# EAGLE schematic ESP32 Adapter Board (EAGLE 9.3.2)
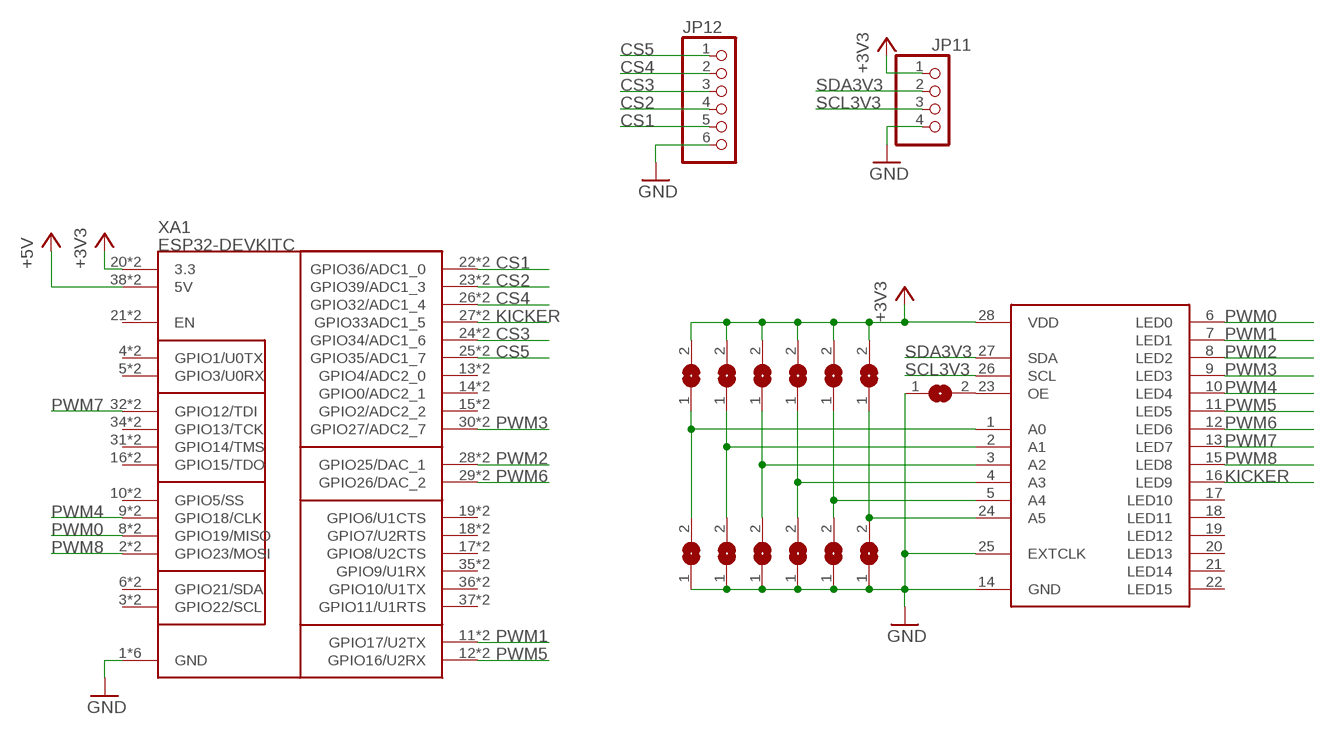
[diagram p0: schematic, sheet 1]

## Parts
JP11  PINHD-1X4  [1X04]
JP12  PINHD-1X6  [1X06]
SJ1  SJ  [SJ]
SJ2  SJ  [SJ]
SJ3  SJ  [SJ]
SJ4  SJ  [SJ]
SJ5  SJ  [SJ]
SJ6  SJ  [SJ]
SJ7  SJ  [SJ]
SJ8  SJ  [SJ]
SJ9  SJ  [SJ]
SJ10  SJ  [SJ]
SJ11  SJ  [SJ]
SJ12  SJ  [SJ]
SJ13  SJ  [SJ]
U1  PCA9685  [SOP65P640X110-28]
XA1  ESP32-DEVKITC  [ESP32_DEVKITC]

## Nets
+3V3: JP11.1 SJ7.2 SJ8.2 SJ9.2 SJ10.2 SJ11.2 SJ12.2 U1.28(VDD) XA1.20(3.3) XA1.60(3.3)
+5V: XA1.38(5V) XA1.78(5V)
CS1: JP12.5 XA1.22(GPIO36/ADC1_0) XA1.62(GPIO36/ADC1_0)
CS2: JP12.4 XA1.23(GPIO39/ADC1_3) XA1.63(GPIO39/ADC1_3)
CS3: JP12.3 XA1.24(GPIO34/ADC1_6) XA1.64(GPIO34/ADC1_6)
CS4: JP12.2 XA1.26(GPIO32/ADC1_4) XA1.66(GPIO32/ADC1_4)
CS5: JP12.1 XA1.25(GPIO35/ADC1_7) XA1.65(GPIO35/ADC1_7)
GND: JP11.4 JP12.6 SJ1.1 SJ2.1 SJ3.1 SJ4.1 SJ5.1 SJ6.1 SJ13.1 U1.14(GND) U1.25(EXTCLK) XA1.1(GND) XA1.7(GND) XA1.33(GND) XA1.41(GND) XA1.47(GND) XA1.73(GND)
KICKER: U1.16(LED9) XA1.27(GPIO33ADC1_5) XA1.67(GPIO33ADC1_5)
N$3: SJ6.2 SJ12.1 U1.1(A0)
N$4: SJ5.2 SJ11.1 U1.2(A1)
N$5: SJ4.2 SJ10.1 U1.3(A2)
N$6: SJ3.2 SJ9.1 U1.4(A3)
N$7: SJ2.2 SJ8.1 U1.5(A4)
N$8: SJ1.2 SJ7.1 U1.24(A5)
N$9: SJ13.2 U1.23(OE)
PWM0: U1.6(LED0) XA1.8(GPIO19/MISO) XA1.48(GPIO19/MISO)
PWM1: U1.7(LED1) XA1.11(GPIO17/U2TX) XA1.51(GPIO17/U2TX)
PWM2: U1.8(LED2) XA1.28(GPIO25/DAC_1) XA1.68(GPIO25/DAC_1)
PWM3: U1.9(LED3) XA1.30(GPIO27/ADC2_7) XA1.70(GPIO27/ADC2_7)
PWM4: U1.10(LED4) XA1.9(GPIO18/CLK) XA1.49(GPIO18/CLK)
PWM5: U1.11(LED5) XA1.12(GPIO16/U2RX) XA1.52(GPIO16/U2RX)
PWM6: U1.12(LED6) XA1.29(GPIO26/DAC_2) XA1.69(GPIO26/DAC_2)
PWM7: U1.13(LED7) XA1.32(GPIO12/TDI) XA1.72(GPIO12/TDI)
PWM8: U1.15(LED8) XA1.2(GPIO23/MOSI) XA1.42(GPIO23/MOSI)
SCL3V3: JP11.3 U1.26(SCL)
SDA3V3: JP11.2 U1.27(SDA)
Unconnected: U1.17(LED10) U1.18(LED11) U1.19(LED12) U1.20(LED13) U1.21(LED14) U1.22(LED15) XA1.3(GPIO22/SCL) XA1.4(GPIO1/U0TX) XA1.5(GPIO3/U0RX) XA1.6(GPIO21/SDA) XA1.10(GPIO5/SS) XA1.13(GPIO4/ADC2_0) XA1.14(GPIO0/ADC2_1) XA1.15(GPIO2/ADC2_2) XA1.16(GPIO15/TDO) XA1.17(GPIO8/U2CTS) XA1.18(GPIO7/U2RTS) XA1.19(GPIO6/U1CTS) XA1.21(EN) XA1.31(GPIO14/TMS) XA1.34(GPIO13/TCK) XA1.35(GPIO9/U1RX) XA1.36(GPIO10/U1TX) XA1.37(GPIO11/U1RTS) XA1.43(GPIO22/SCL) XA1.44(GPIO1/U0TX) XA1.45(GPIO3/U0RX) XA1.46(GPIO21/SDA) XA1.50(GPIO5/SS) XA1.53(GPIO4/ADC2_0) XA1.54(GPIO0/ADC2_1) XA1.55(GPIO2/ADC2_2) XA1.56(GPIO15/TDO) XA1.57(GPIO8/U2CTS) XA1.58(GPIO7/U2RTS) XA1.59(GPIO6/U1CTS) XA1.61(EN) XA1.71(GPIO14/TMS) XA1.74(GPIO13/TCK) XA1.75(GPIO9/U1RX) XA1.76(GPIO10/U1TX) XA1.77(GPIO11/U1RTS)

## Library data of the parts
JP11 = pinhead:PINHD-1X4: PIN HEADER
JP12 = pinhead:PINHD-1X6: PIN HEADER
SJ1-SJ13 = jumper:SJ: SMD solder JUMPER
U1 = Robocup2019:PCA9685
XA1 = Robocup:ESP32-DEVKITC: WiFi / 802.11 Development Tools ESP32 General Development Kit, ESP-WROOM-32 on the board Source: Datasheet <http://esp-idf.readthedocs.io/en/latest/get-started/get-started-devkitc.html>

## Net classes
0 default: width 0.203 mm